# EAGLE schematic MidiMon_B (EAGLE 9.3.0)
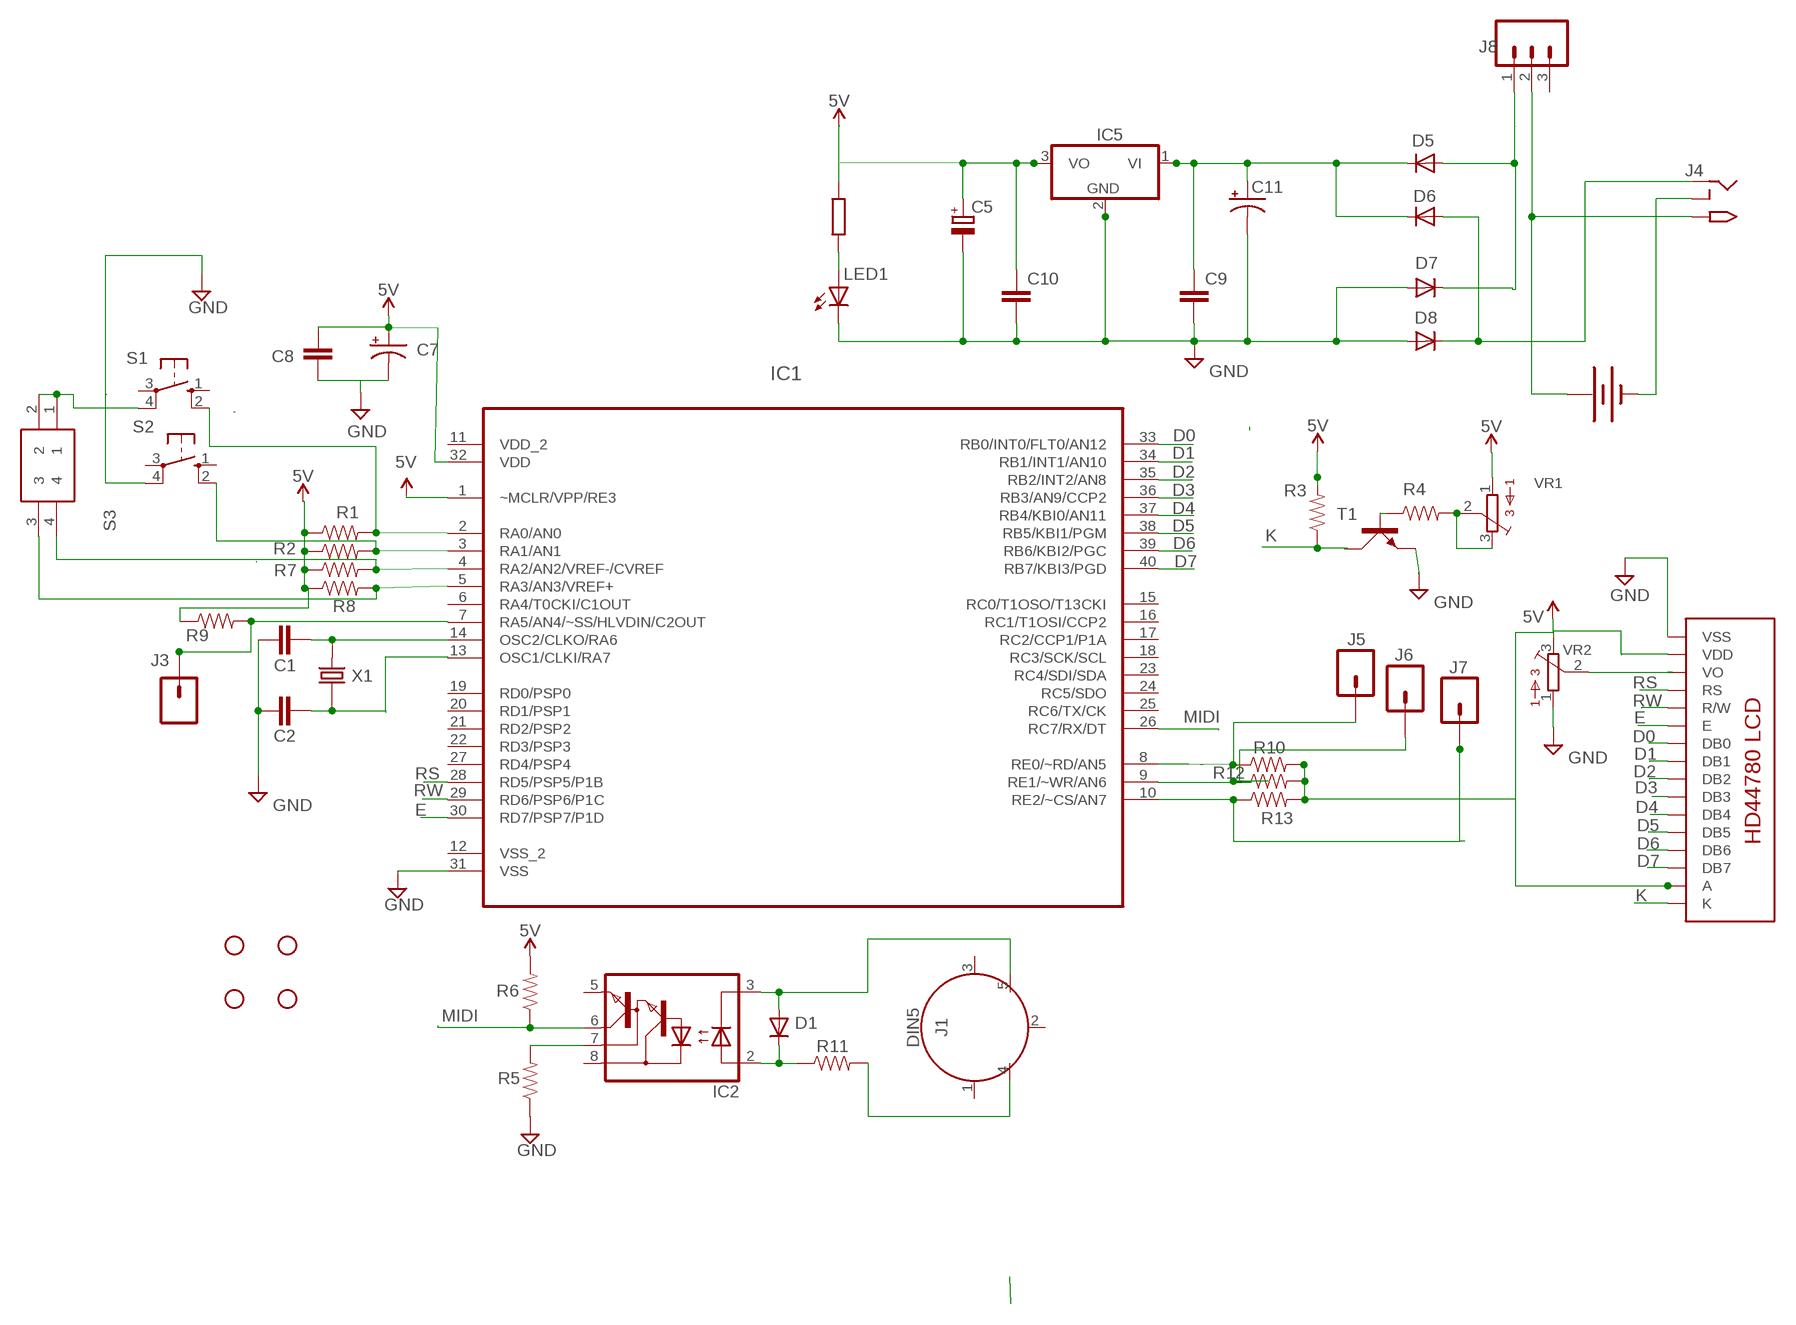
[diagram p0: schematic, sheet 1]

## Parts
BAT1  BATTERY  [PP3_BATTERBOX]
C1  18pF  22PF-PTH-2.54MM-200V-5%  [CAP-PTH-2.54]
C2  18pF  22PF-PTH-2.54MM-200V-5%  [CAP-PTH-2.54]
C5  10uf  CPOL-EUE2.5-7  [E2,5-7]
C7  10uF  10UF-POLAR-RADIAL-2.5MM-25V-20%  [CPOL-RADIAL-2.5MM-5MM]
C8  0.1uF  0.1UF-KIT-EZ-50V-20%  [CAP-PTH-SMALL-KIT]
C9  330nf  C-EU025-024X044  [C025-024X044]
C10  100nf  C-EU025-024X044  [C025-024X044]
C11  2200uf  CPOL-USE5-10.5  [E5-10,5]
D1  DIODEDO-1N4148  [DO-1N4148]
D5  1N4004  [DO-VERT]
D6  1N4004  [DO-VERT]
D7  1N4004  [DO-VERT]
D8  1N4004  [DO-VERT]
H1  STAND-OFFTIGHT  [STAND-OFF-TIGHT]
H2  STAND-OFFTIGHT  [STAND-OFF-TIGHT]
H3  STAND-OFFTIGHT  [STAND-OFF-TIGHT]
H4  STAND-OFFTIGHT  [STAND-OFF-TIGHT]
IC1  PIC18F4520-I/P  [DIP254P1524X533-40]
IC2  6N138  [DIL08]
IC5  7805TV  [TO220V]
J1  DIN5  [DIN5-RA-PTH]
J3  CONN_01  [1X01]
J4  2.1MMJACKTHM  [PJ-102A]
J5  CONN_01  [1X01]
J6  CONN_01  [1X01]
J7  CONN_01  [1X01]
J8  CONN_03  [1X03]
LED1  LED3MM  [LED3MM]
R1  10k  1KOHM-HORIZ-1/4W-5%  [AXIAL-0.3]
R2  10k  1KOHM-HORIZ-1/4W-5%  [AXIAL-0.3]
R3  10k  1KOHM-HORIZ-1/4W-5%  [AXIAL-0.3]
R4  10k  1KOHM-HORIZ-1/4W-5%  [AXIAL-0.3]
R5  5.6k  1KOHM-HORIZ-1/4W-5%  [AXIAL-0.3]
R6  1.2k  1KOHM-HORIZ-1/4W-5%  [AXIAL-0.3]
R7  10k  1KOHM-HORIZ-1/4W-5%  [AXIAL-0.3]
R8  10k  1KOHM-HORIZ-1/4W-5%  [AXIAL-0.3]
R9  10k  1KOHM-HORIZ-1/4W-5%  [AXIAL-0.3]
R10  10k  1KOHM-HORIZ-1/4W-5%  [AXIAL-0.3]
R11  220  1KOHM-HORIZ-1/4W-5%  [AXIAL-0.3]
R12  10k  1KOHM-HORIZ-1/4W-5%  [AXIAL-0.3]
R13  10k  1KOHM-HORIZ-1/4W-5%  [AXIAL-0.3]
R20  1k  R-EU_0207/7  [0207/7]
S1  40-XX  [B3F-40XX]
S2  40-XX  [B3F-40XX]
S3  195-2MST  [DIPS774W56P254L726H790Q4N]
T1  2N3904  [TO92D]
U$2  LCD-HD4478020X4-3HOLES  [LCD-20X4-3HOLES]
VR1  BOURNS_3362P_TRIMMERP  [BOURNS_3362P_TRIMMER]
VR2  BOURNS_3362P_TRIMMERP  [BOURNS_3362P_TRIMMER]
X1  ECS-100-18-4X  [XTAL_ECS-100-18-4X]

## Nets
5V: C7.1(+) C8.2 IC1.1(~MCLR/VPP/RE3) IC1.32(VDD) R1.P$1 R2.P$1 R3.P$2 R6.P$2 R7.P$1 R8.P$1 R9.P$1 R10.P$2 R12.P$2 R13.P$2 U$2.P$15(A) VR1.1
D0: IC1.33(RB0/INT0/FLT0/AN12) U$2.P$7(DB0)
D1: IC1.34(RB1/INT1/AN10) U$2.P$8(DB1)
D2: IC1.35(RB2/INT2/AN8) U$2.P$9(DB2)
D3: IC1.36(RB3/AN9/CCP2) U$2.P$10(DB3)
D4: IC1.37(RB4/KBI0/AN11) U$2.P$11(DB4)
D5: IC1.38(RB5/KBI1/PGM) U$2.P$12(DB5)
D6: IC1.39(RB6/KBI2/PGC) U$2.P$13(DB6)
D7: IC1.40(RB7/KBI3/PGD) U$2.P$14(DB7)
E: IC1.30(RD7/PSP7/P1D) U$2.P$6(E)
GND: C1.1 C2.1 C5.- C7.2(-) C8.1 C9.2 C10.2 C11.- D7.A D8.A IC1.31(VSS) IC5.2(GND) LED1.K(C) R5.P$1 S1.4(P1) S2.4(P1) S3.1 S3.2 T1.E U$2.P$1(VSS) VR2.1
K: R3.P$1 T1.C U$2.P$16(K)
MIDI: IC1.26(RC7/RX/DT) IC2.6(VO) R6.P$1
N$1: BAT1.0V(-) J4.RING_SW
N$2: R4.P$2 VR1.2 VR1.3
N$3: IC2.7(VB) R5.P$2
N$4: D1.C IC2.2(A) R11.P$1
N$5: J1.4 R11.P$2
N$6: D1.A IC2.3(C) J1.5
N$7: C1.2 IC1.14(OSC2/CLKO/RA6) X1.2
N$9: C2.2 IC1.13(OSC1/CLKI/RA7) X1.1
N$10: D5.A D7.C J8.1
N$13: IC1.4(RA2/AN2/VREF-/CVREF) R7.P$2 S3.4
N$14: IC1.2(RA0/AN0) R1.P$2 S1.2(S1)
N$15: IC1.3(RA1/AN1) R2.P$2 S2.2(S1)
N$17: IC1.5(RA3/AN3/VREF+) R8.P$2 S3.3
N$18: U$2.P$2(VDD) VR2.3
N$19: LED1.A R20.2
N$20: IC1.7(RA5/AN4/~SS/HLVDIN/C2OUT) J3.1 R9.P$2
N$22: D6.A D8.C J4.RING
N$23: C5.+ C10.1 IC5.3(VO) R20.1
N$24: U$2.P$3(VO) VR2.2
N$28: R4.P$1 T1.B
N$29: IC1.9(RE1/~WR/AN6) J6.1 R12.P$1
N$30: IC1.8(RE0/~RD/AN5) J5.1 R10.P$1
N$31: IC1.10(RE2/~CS/AN7) J7.1 R13.P$1
PWR+1: BAT1.9V(+) J4.TIP J8.2
RS: IC1.28(RD5/PSP5/P1B) U$2.P$4(RS)
RW: IC1.29(RD6/PSP6/P1C) U$2.P$5(R/W)
VIN: C9.1 C11.+ D5.C D6.C IC5.1(VI)
Unconnected: IC1.6(RA4/T0CKI/C1OUT) IC1.15(RC0/T1OSO/T13CKI) IC1.16(RC1/T1OSI/CCP2) IC1.17(RC2/CCP1/P1A) IC1.18(RC3/SCK/SCL) IC1.19(RD0/PSP0) IC1.20(RD1/PSP1) IC1.21(RD2/PSP2) IC1.22(RD3/PSP3) IC1.23(RC4/SDI/SDA) IC1.24(RC5/SDO) IC1.25(RC6/TX/CK) IC1.27(RD4/PSP4) IC2.5(GND) IC2.8(VCC) J1.1 J1.2 J1.3 J8.3 S1.1(S) S1.3(P) S2.1(S) S2.3(P)

## Power pins joined to a net without a drawn wire
VDD_2: IC1.11(VDD_2)
VSS_2: IC1.12(VSS_2)

## Library data of the parts
BAT1 = jasons_stuff:BATTERY: Battery Holders Various common sizes : AA, AAA, 20mm coin cell and 12mm coin cell.
C1 C2 = SparkFun-Capacitors:22PF: 22pF ceramic capacitors A capacitor is a passive two-terminal electrical component used to store electrical energy temporarily in an electric field.; PROD_ID: CAP-09128; VALUE: 22pF
C5 = rcl:CPOL-EU: POLARIZED CAPACITOR, European symbol
C7 = SparkFun-Capacitors:10UF-POLAR: 10.0µF polarized capacitors A capacitor is a passive two-terminal electrical component used to store electrical energy temporarily in an electric field.; PROD_ID: CAP-08440
C8 = SparkFun-Capacitors:0.1UF: 0.1µF ceramic capacitors A capacitor is a passive two-terminal electrical component used to store electrical energy temporarily in an electric field.; PROD_ID: CAP-08370
C9 C10 = rcl:C-EU: CAPACITOR, European symbol
C11 = adafruit:CPOL-US: POLARIZED CAPACITOR, American symbol
D1 = adafruit:DIODE: Diode SMADIODE - SMA Surface Mount Package 20V 1A Schottky Diode Digikey: 641-1014-6-ND DO-1N4148 - Through Hole Small Current Diode SOD-123 20V 1 A (.5mV Vf) Schottky Diode - Digikey: MBRX120TPMSCT-ND SOD-323 10V 570mA (.38mV Vf, 3ns) Schottky Diode - Digikey: ZLLS410CT-ND SOD-523 30V 30mA Schottky Diode (RB751S-40TE61) - Digikey: RB751S-40TE61CT-ND SOT23-R/W - SOT23 Package (R = Solder Paste/Reflow Ovens, W = Hand-Soldering) BAT54Film 40V 300mA - Digikey: 497-7162-1-ND
D5-D8 = jasons_stuff:1N4004: DIODE general purpose rectifier, 1 A
H1-H4 = SparkFun-Hardware:STAND-OFF: Stand Off Drill holes for mechanically mounting via screws, standoffs, etc. Note: Use the keepout ring to avoid running the screw head into surrounding components. Variant Overviews STAND-OFF - Mechanical footprint for a #4 phillips button head screw. STAND-OFF-TIGHT - Mechanical footprint for a #4 phillips button head screw, Example SparkFun Products Screw - Phillips Head (1/4", 4-40, 10 pack) <https://www.sparkfun.com/products/10453> (PRT-10453) Screw - Phillips Head (1/2", 4-40, 10 pack) <https://www.sparkfun.com/products/10452> (PRT-10452) Screw - Phillips Head (3/4", 4-40, 10 pack) <https://www.sparkfun.com/products/10451> (PRT-10451) Screw - Phillips Head (1", 4-40, 10 pack) <https://www.sparkfun.com/products/10450> (PRT-10450)
IC1 = PIC18F4520-I_P:PIC18F4520-I/P: Flash Microcontrollers; AVAILABILITY: Unavailable; DESCRIPTION: PIC18 Series 1.5 kB RAM 32 kB Flash 36 I/O 8-Bit Microcontroller - PDIP-40; MF: Microchip; MP: PIC18F4520-I/P; PACKAGE: TQFP-44 Microchip; PRICE: None
IC2 = optocoupler:6N138: MOTOROLA OPTO COUPLER; MF: VISHAY/TELEFUNKEN; MPN: 6N138; OC_FARNELL: 9860150; OC_NEWARK: 35K5294
IC5 = linear:78*: Positive VOLTAGE REGULATOR Source: http://cache.national.com/ds/LM/LM78L05.pdf http://www.fairchildsemi.com/ds/LM/LM7805.pdf
J1 = SparkFun-Connectors:DIN5: DIN5 Connector - Female Right Angle (frequently used as a MIDI Jack connector) This type of connector and cable is frequently used for transmitting midi data (musical instrument digital interface). It is what you usually see on a keyboard or set of electronic drums. Learn more here <https://en.wikipedia.org/wiki/MIDI>. For more information on the pinout and electrical specifications of MIDI communications, please see the following resource: https://www.midi.org/specifications/item/midi-din-electrical-specification Here is the connector we sell at SparkFun: MIDI Connector - Female Right Angle <https://www.sparkfun.com/products/9536> (PRT-09536) Datasheet <hhttp://www.sparkfun.com/datasheets/Prototyping/Connectors/MIDI-RA.pdf> It is used on this SparkFun product: SparkFun MIDI Shield <https://www.sparkfun.com/products/12898> (DEV-12898); PROD_ID: CONN-09481
J3 J5-J7 = SparkFun-Connectors:CONN_01: Single connection point. Often used as Generic Header-pin footprint for 0.1 inch spaced/style header connections On any of the 0.1 inch spaced packages, you can populate with these: Break Away Headers - Straight <https://www.sparkfun.com/products/116> (PRT-00116) Break Away Male Headers - Right Angle <https://www.sparkfun.com/products/553> (PRT-00553) Female Headers <https://www.sparkfun.com/products/115> (PRT-00115) Break Away Headers - Machine Pin <https://www.sparkfun.com/products/117> (PRT-00117) Break Away Female Headers - Swiss Machine Pin <https://www.sparkfun.com/products/743> (PRT-00743) This device is also useful as a general connection point to wire up your design to another part of your project. Our various solder wires solder well into these plated through hole pads. Hook-Up Wire - Assortment (Stranded, 22 AWG) <https://www.sparkfun.com/products/11375> (PRT-11375) Hook-Up Wire - Assortment (Solid Core, 22 AWG) <https://www.sparkfun.com/products/11367> (PRT-11367) View the entire wire category on our website here <https://www.sparkfun.com/categories/141> Special notes: SMTSO-256-ET is a "flush mount" nut for a 4-40 screw. We mostly use this on specialty testbeds; it is a nice way to connect hardware to your PCB at an adjustable hieght. Also note, the SNAP packages are for using a snappable style connector. We sell a baggie of snaps and they are also used on two LilyPad designs: Snap Assortment - 30 pack (male and female) <https://www.sparkfun.com/products/11347> (DEV-11347) LilyPad Arduino SimpleSnap <https://www.sparkfun.com/products/10941> (DEV-10941) LilyPad SimpleSnap Protoboard <https://www.sparkfun.com/products/10940> (DEV-10940)
J4 = adafruit:2.1MMJACK: 2.1mm x 5.5mm THM DC jack with internal switch. Digikey part #PJ-102A, 4UCON part #05537 2.1mm x 5.5mm SMT DC jack with internal switch. Digikey part #PJ-002A-SMT, 4UCON part #03267 By microbuilder.eu & adafruit.com
J8 = SparkFun-Connectors:CONN_03: Multi connection point. Often used as Generic Header-pin footprint for 0.1 inch spaced/style header connections On any of the 0.1 inch spaced packages, you can populate with these: Break Away Headers - Straight <https://www.sparkfun.com/products/116> (PRT-00116) Break Away Male Headers - Right Angle <https://www.sparkfun.com/products/553> (PRT-00553) Female Headers <https://www.sparkfun.com/products/115> (PRT-00115) Break Away Headers - Machine Pin <https://www.sparkfun.com/products/117> (PRT-00117) Break Away Female Headers - Swiss Machine Pin <https://www.sparkfun.com/products/743> (PRT-00743) Stackable Header - 3 Pin (Female, 0.1") <https://www.sparkfun.com/products/13875> (PRT-13875) For SCREWTERMINALS and SPRING TERMINALS visit here: Screw Terimnals on SparkFun.com <https://www.sparkfun.com/search/results?term=Screw+Terminals> (5mm/3.5mm/2.54mm spacing) This device is also useful as a general connection point to wire up your design to another part of your project. Our various solder wires solder well into these plated through hole pads. Hook-Up Wire - Assortment (Stranded, 22 AWG) <https://www.sparkfun.com/products/11375> (PRT-11375) Hook-Up Wire - Assortment (Solid Core, 22 AWG) <https://www.sparkfun.com/products/11367> (PRT-11367) View the entire wire category on our website here <https://www.sparkfun.com/categories/141> Special notes: Molex polarized connector foot print use with SKU : PRT-08232 with associated crimp pins and housings.
LED1 = adafruit:LED: LED OSRAM: - CHIPLED LG R971, LG N971, LY N971, LG Q971, LY Q971, LO R971, LY R971 LH N974, LH R974 LS Q976, LO Q976, LY Q976 LO Q996 - Hyper CHIPLED LW Q18S LB Q993, LB Q99A, LB R99A - SideLED LS A670, LO A670, LY A670, LG A670, LP A670 LB A673, LV A673, LT A673, LW A673 LH A674 LY A675 LS A676, LA A676, LO A676, LY A676, LW A676 LS A679, LY A679, LG A679 - Hyper Micro SIDELED® LS Y876, LA Y876, LO Y876, LY Y876 LT Y87S - SmartLED LW L88C, LW L88S LB L89C, LB L89S, LG L890 LS L89K, LO L89K, LY L89K LS L896, LA L896, LO L896, LY L896 - TOPLED LS T670, LO T670, LY T670, LG T670, LP T670 LSG T670, LSP T670, LSY T670, LOP T670, LYG T670 LG T671, LOG T671, LSG T671 LB T673, LV T673, LT T673, LW T673 LH T674 LS T676, LA T676, LO T676, LY T676, LB T676, LH T676, LSB T676, LW T676 LB T67C, LV T67C, LT T67C, LS T67K, LO T67K, LY T67K, LW E67C LS E67B, LA E67B, LO E67B, LY E67B, LB E67C, LV E67C, LT E67C LW T67C LS T679, LY T679, LG T679 LS T770, LO T770, LY T770, LG T770, LP T770 LB T773, LV T773, LT T773, LW T773 LH T774 LS E675, LA E675, LY E675, LS T675 LS T776, LA T776, LO T776, LY T776, LB T776 LHGB T686 LT T68C, LB T68C - Hyper Mini TOPLED® LB M676 - Mini TOPLED Santana® LG M470 LS M47K, LO M47K, LY M47K Source: http://www.osram.convergy.de/
R1-R13 = SparkFun-Resistors:1KOHM: 1kΩ resistor A resistor is a passive two-terminal electrical component that implements electrical resistance as a circuit element. Resistors act to reduce current flow, and, at the same time, act to lower voltage levels within circuits. - Wikipedia; PROD_ID: RES-08380; VALUE: 1k
R20 = rcl:R-EU_: RESISTOR, European symbol
S1 S2 = adafruit:40-XX: OMRON SWITCH; MF: OMRON COMPONENTS USA; MPN: B3F-4000; OC_FARNELL: 176434; OC_NEWARK: 36K3105
S3 = SamacSys_Parts:195-2MST: Switch DIP OFF ON SPST 2 Piano 0.05A 24VDC PC Pins 2.54mm Thru-Hole Tube Source: Datasheet <https://componentsearchengine.com/Datasheets/1/195-2MST.pdf>; DESCRIPTION: Switch DIP OFF ON SPST 2 Piano 0.05A 24VDC PC Pins 2.54mm Thru-Hole Tube; HEIGHT: 7.9mm; MANUFACTURER_NAME: CTS; MANUFACTURER_PART_NUMBER: 195-2MST; MOUSER_PART_NUMBER: 774-1952MST
T1 = transistor-small-signal:2N3904: NPN TRANSISTOR
U$2 = HD44780LCD:LCD-HD44780
VR1 VR2 = MusicThingModular:BOURNS_3362P_TRIMMER: 3362 Series 1/4" Square Trimmer
X1 = ECS-100-18-4X:ECS-100-18-4X: CRYSTAL T/H; DESCRIPTION: Crystal 10MHz ±30ppm _Tol_ ±50ppm _Stability_ 18pF FUND 60Ohm 2-Pin HC-49/USX Thru-Hole; DIGI-KEY_PART_NUMBER: X1080-ND; DIGI-KEY_PURCHASE_URL: https://www.digikey.ca/product-detail/en/ecs-inc/ECS-100-18-4X/X1080-ND/827571?utm_source=snapeda&utm_medium=aggregator&utm_campaign=symbol; MF: ECS Inc.; MP: ECS-100-18-4X; PACKAGE: HC49/US ECS International

## Net classes
0 default: width 0.508 mm, drill 0.508 mm, clearance 0.508 mm